# EAGLE design sparkpunk (EAGLE 6.5.0)
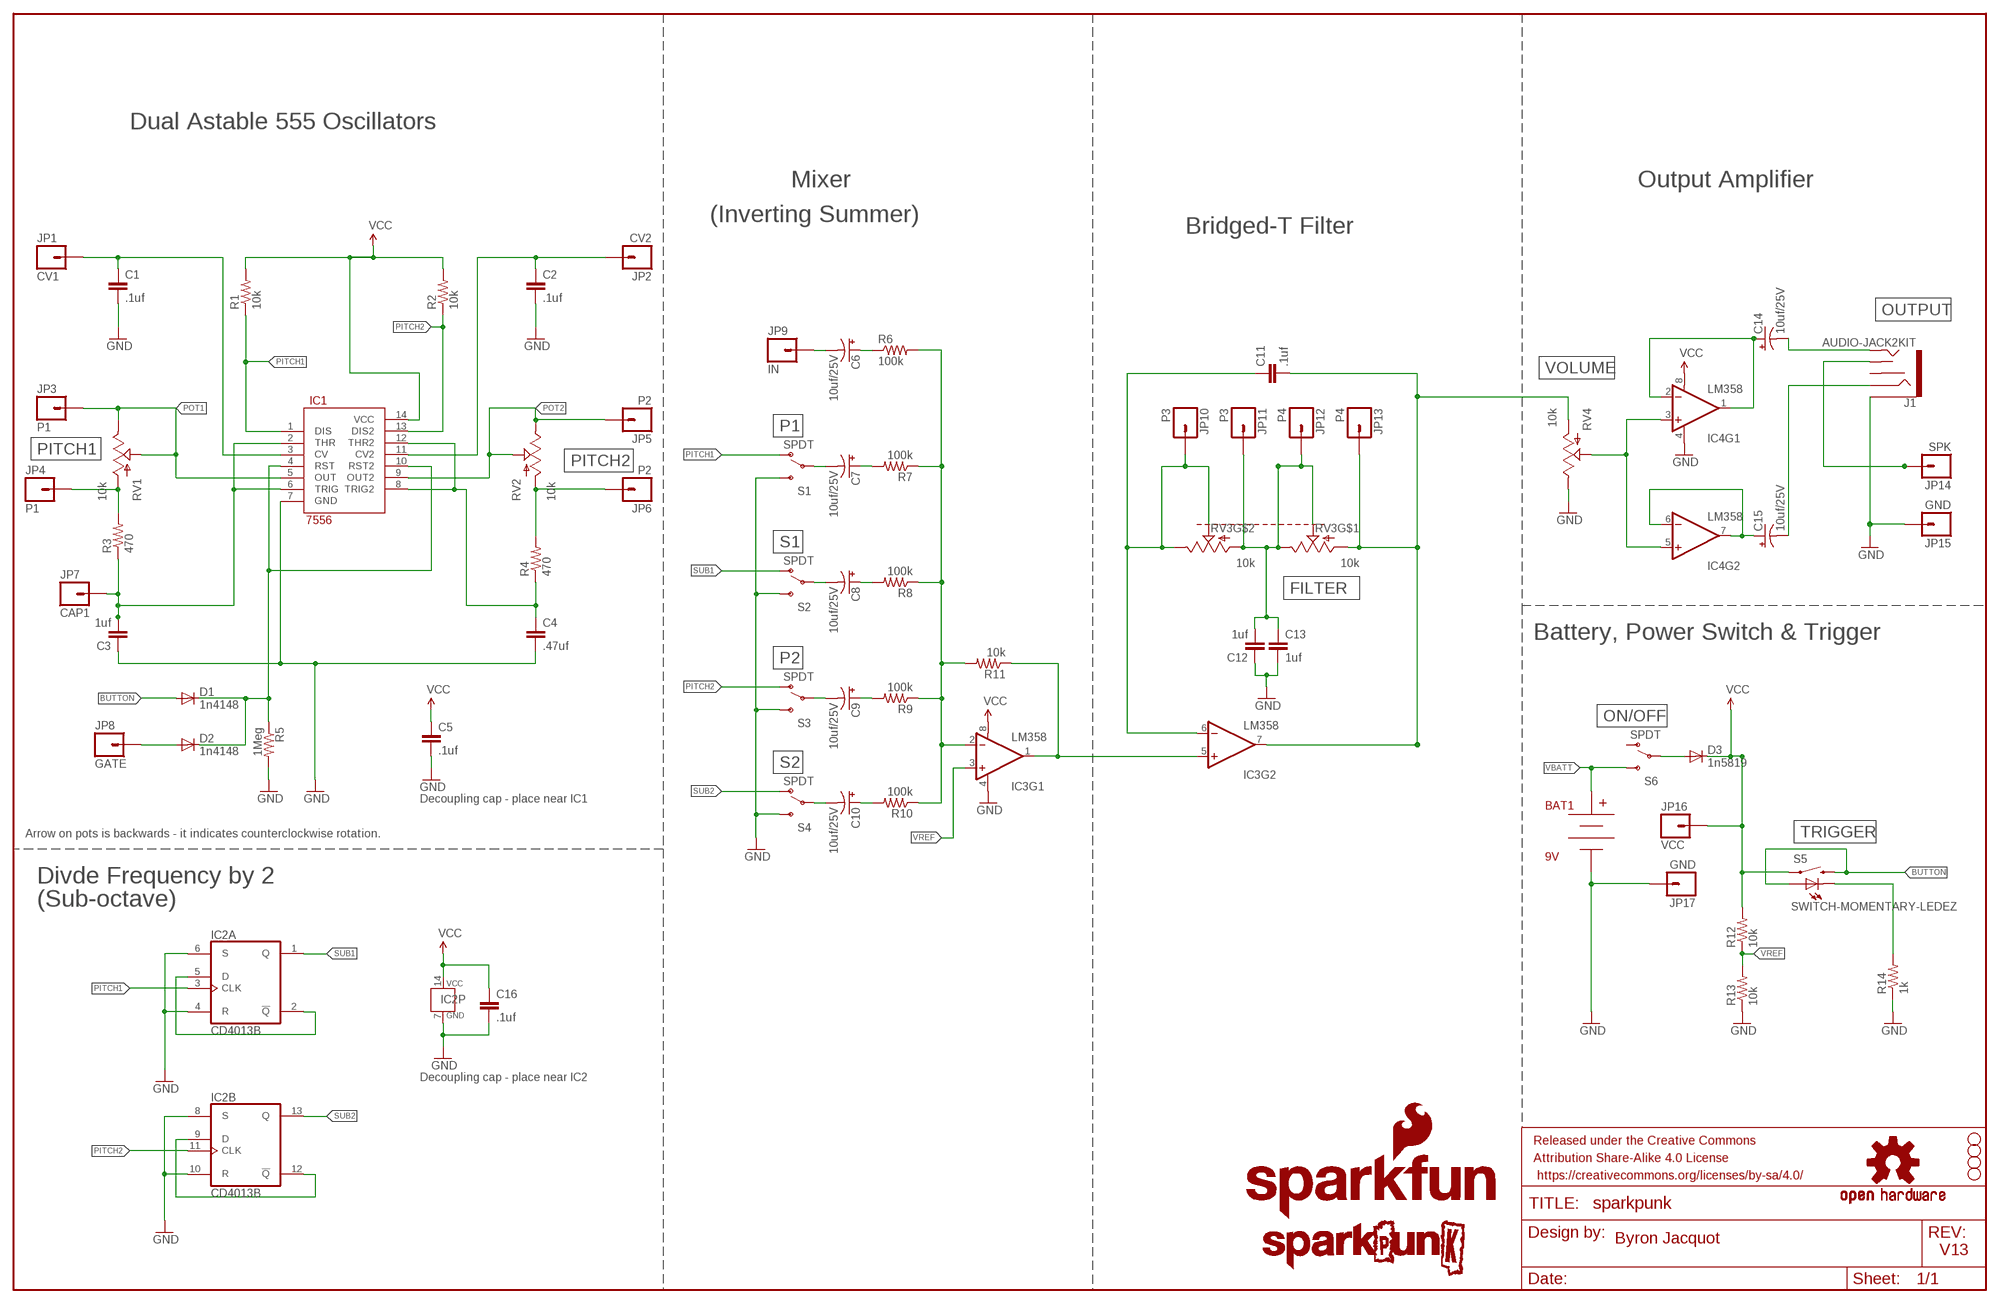
[diagram p0: schematic, sheet 1]

## Parts
BAT1  9V  BC9VPCKIT_SOLDERMASK  [BC9VPC_KIT]
C1  .1uf  CAPKIT  [CAP-PTH-SMALL-KIT]
C2  .1uf  CAPKIT  [CAP-PTH-SMALL-KIT]
C3  1uf  CAPKIT  [CAP-PTH-SMALL-KIT]
C4  .47uf  CAPKIT  [CAP-PTH-SMALL-KIT]
C5  .1uf  CAPKIT  [CAP-PTH-SMALL-KIT]
C6  10uf/25V  10UF-25V-20%(PTH)KIT  [CPOL-RADIAL-10UF-25V-KIT]
C7  10uf/25V  10UF-25V-20%(PTH)KIT  [CPOL-RADIAL-10UF-25V-KIT]
C8  10uf/25V  10UF-25V-20%(PTH)KIT  [CPOL-RADIAL-10UF-25V-KIT]
C9  10uf/25V  10UF-25V-20%(PTH)KIT  [CPOL-RADIAL-10UF-25V-KIT]
C10  10uf/25V  10UF-25V-20%(PTH)KIT  [CPOL-RADIAL-10UF-25V-KIT]
C11  .1uf  CAPKIT  [CAP-PTH-SMALL-KIT]
C12  1uf  CAPKIT  [CAP-PTH-SMALL-KIT]
C13  1uf  CAPKIT  [CAP-PTH-SMALL-KIT]
C14  10uf/25V  10UF-25V-20%(PTH)KIT  [CPOL-RADIAL-10UF-25V-KIT]
C15  10uf/25V  10UF-25V-20%(PTH)KIT  [CPOL-RADIAL-10UF-25V-KIT]
C16  .1uf  CAPKIT  [CAP-PTH-SMALL-KIT]
D1  1n4148  DIODEKIT  [DIODE-1N4148-KIT]
D2  1n4148  DIODEKIT  [DIODE-1N4148-KIT]
D3  1n5819  DIODE  [DIODE-1N4001-KIT]
FRAME1  FRAME-LEDGER  [CREATIVE_COMMONS]
IC1  7556  556KIT  [DIL14-KIT]
IC2  CD4013B  CD4013  [DIL14-KIT]
IC3  LM358  LM358KIT  [DIP08-KIT]
IC4  LM358  LM358KIT  [DIP08-KIT]
J1  AUDIO-JACK2KIT  [AUDIO-JACK-KIT]
JP1  CV1  M01SMDNS  [1X01NS]
JP2  CV2  M01SMDNS  [1X01NS]
JP3  P1  M01SMDNS  [1X01NS]
JP4  P1  M01SMDNS  [1X01NS]
JP5  P2  M01SMDNS  [1X01NS]
JP6  P2  M01SMDNS  [1X01NS]
JP7  CAP1  M01SMDNS  [1X01NS]
JP8  GATE  M01SMDNS  [1X01NS]
JP9  IN  M01SMDNS  [1X01NS]
JP10  P3  M01SMDNS  [1X01NS]
JP11  P3  M01SMDNS  [1X01NS]
JP12  P4  M01SMDNS  [1X01NS]
JP13  P4  M01SMDNS  [1X01NS]
JP14  SPK  M01SMDNS  [1X01NS]
JP15  GND  M01SMDNS  [1X01NS]
JP16  VCC  M01SMDNS  [1X01NS]
JP17  GND  M01SMDNS  [1X01NS]
LOGO1  SFE_LOGO_NAME_FLAME.2_INCH  [SFE_LOGO_NAME_FLAME_.2]
LOGO2  SPARKPUNK_LOGO.1INCH_TALL  [SPARKPUNK_LOGO_.1]
LOGO3  OSHW-LOGOM  [OSHW-LOGO-M]
LOGO4  OSHW-LOGOM  [OSHW-LOGO-M]
R1  10k  RESISTOREZ  [AXIAL-0.3EZ]
R2  10k  RESISTOREZ  [AXIAL-0.3EZ]
R3  470  RESISTOREZ  [AXIAL-0.3EZ]
R4  470  RESISTOREZ  [AXIAL-0.3EZ]
R5  1Meg  RESISTOREZ  [AXIAL-0.3EZ]
R6  100k  RESISTOREZ  [AXIAL-0.3EZ]
R7  100k  RESISTOREZ  [AXIAL-0.3EZ]
R8  100k  RESISTOREZ  [AXIAL-0.3EZ]
R9  100k  RESISTOREZ  [AXIAL-0.3EZ]
R10  100k  RESISTOREZ  [AXIAL-0.3EZ]
R11  10k  RESISTOREZ  [AXIAL-0.3EZ]
R12  10k  RESISTOREZ  [AXIAL-0.3EZ]
R13  10k  RESISTOREZ  [AXIAL-0.3EZ]
R14  1k  RESISTOREZ  [AXIAL-0.3EZ]
RV1  10k  POTALPS-KIT  [ALPS_POT_KIT]
RV2  10k  POTALPS-KIT  [ALPS_POT_KIT]
RV3  10k  POT_DUAL  [POT_PANASONIC_DUAL_VERT_KIT]
RV4  10k  POTALPS-KIT  [ALPS_POT_KIT]
S1  SPDT  SWITCH-SPDTKIT  [SWITCH-SPDT_KIT]
S2  SPDT  SWITCH-SPDTKIT  [SWITCH-SPDT_KIT]
S3  SPDT  SWITCH-SPDTKIT  [SWITCH-SPDT_KIT]
S4  SPDT  SWITCH-SPDTKIT  [SWITCH-SPDT_KIT]
S5  SWITCH-MOMENTARY-LEDEZ  [TACTILE-PTH-LED-12MM-EZ]
S6  SPDT  SWITCH-SPDTKIT  [SWITCH-SPDT_KIT]
STANDOFF1  STAND-OFF  [STAND-OFF]
STANDOFF2  STAND-OFF  [STAND-OFF]
STANDOFF3  STAND-OFF  [STAND-OFF]
STANDOFF4  STAND-OFF  [STAND-OFF]

## Nets
BUTTON: D1.A S5.2 S5.A
FILT-OUT: C11.2 IC3.7(OUT) JP13.1 RV3.A3(A) RV4.P$3(A)
GND: BAT1.V- C1.2 C2.2 C3.1 C4.2 C5.2 C12.1 C13.2 C16.2 IC1.7(GND) IC2.4(A:R) IC2.6(A:S) IC2.7(P:GND) IC2.8(B:S) IC2.10(B:R) IC3.4(V-) IC4.4(V-) J1.SLEEVE JP15.1 JP17.1 R5.P$2 R13.P$1 R14.P$1 RV4.P$1(E) S1.3(S) S2.3(S) S3.3(S) S4.3(S)
N: IC4.3(+IN) IC4.5(+IN) RV4.P$2(S)
N$1: D2.A JP8.1
N$3: C4.1 IC1.8(TRIG2) IC1.12(THR2) R4.P$1
N$4: D1.C D2.C IC1.4(RST) IC1.10(RST2) R5.P$1
N$7: D3.A S6.2(P)
N$8: JP6.1 R4.P$2 RV2.P$3(A)
N$9: R14.P$2 S5.C
N$10: IC2.2(A:!Q) IC2.5(A:D)
N$11: IC2.9(B:D) IC2.12(B:!Q)
N$12: JP4.1 R3.P$2 RV1.P$3(A)
N$13: C10.2(-) S4.2(P)
N$14: J1.TSH JP14.1
N$16: C14.1(+) IC4.1(OUT) IC4.2(-IN)
N$17: C15.2(-) J1.RING
N$18: C10.1(+) R10.P$2
N$19: C9.1(+) R9.P$2
N$20: C9.2(-) S3.2(P)
N$21: C6.2(-) JP9.1
N$22: C6.1(+) R6.P$1
N$23: C7.2(-) S1.2(P)
N$24: C8.2(-) S2.2(P)
N$25: C15.1(+) IC4.6(-IN) IC4.7(OUT)
N$26: IC3.2(-IN) R6.P$2 R7.P$1 R8.P$1 R9.P$1 R10.P$1 R11.P$2
N$27: IC3.1(OUT) IC3.5(+IN) R11.P$1
N$28: C8.1(+) R8.P$2
N$29: C7.1(+) R7.P$2
N$30: C14.2(-) J1.TIP
N$31: C11.1 IC3.6(-IN) JP10.1 RV3.B1(E) RV3.B2(S)
N$33: C12.2 C13.1 JP11.1 JP12.1 RV3.A1(E) RV3.A2(S) RV3.B3(A)
PITCH1: IC1.1(DIS) IC2.3(A:CLK) R1.P$1 S1.1(O)
PITCH2: IC1.13(DIS2) IC2.11(B:CLK) R2.P$1 S3.1(O)
POT1: IC1.5(OUT) JP3.1 RV1.P$1(E) RV1.P$2(S)
POT2: IC1.9(OUT2) JP5.1 RV2.P$1(E) RV2.P$2(S)
SUB1: IC2.1(A:Q) S2.1(O)
SUB2: IC2.13(B:Q) S4.1(O)
VBATT: BAT1.V+ S6.3(S)
VCAP1: C3.2 IC1.2(THR) IC1.6(TRIG) JP7.1 R3.P$1
VCC: C5.1 C16.1 D3.C IC1.14(VCC) IC2.14(P:VCC) IC3.8(V+) IC4.8(V+) JP16.1 R1.P$2 R2.P$2 R12.P$2 S5.4
VCC1: C2.1 IC1.11(CV2) JP2.1
VCC2: C1.1 IC1.3(CV) JP1.1
VREF: IC3.3(+IN) R12.P$1 R13.P$2
Unconnected: J1.RSH S6.1(O)

## Notes on the sheet
- Dual Astable 555 Oscillators
- Mixer | Output Amplifier
- (Inverting Summer)
- Bridged-T Filter
- OUTPUT
- VOLUME
- P1
- PITCH1
- PITCH2
- S1
- FILTER
- Battery, Power Switch & Trigger
- P2
- ON/OFF
- S2
- Decoupling cap - place near IC1
- Arrow on pots is backwards - it indicates counterclockwise rotation. | TRIGGER
- Divde Frequency by 2
- (Sub-octave)
- Decoupling cap - place near IC2
- Byron Jacquot
- V13

## Library data of the parts
BAT1 = SparkFun-Connectors:BC9VPC: 9V board-mount battery cradle
C1 C2 C5 C11 C16 = SparkFun-Capacitors:CAP: Capacitor Standard 0603 ceramic capacitor, and 0.1" leaded capacitor.; PROD_ID: CAP-08370
C3 C12 = SparkFun-Capacitors:CAP: Capacitor Standard 0603 ceramic capacitor, and 0.1" leaded capacitor.; PROD_ID: CAP-09184
C4 = SparkFun-Capacitors:CAP: Capacitor Standard 0603 ceramic capacitor, and 0.1" leaded capacitor.; PROD_ID: CAP-09152
C6-C10 C14 C15 = SparkFun-Capacitors:10UF-25V-20%(PTH): CAP-08440; PROD_ID: CAP-08440
C13 = SparkFun-Capacitors:CAP: Capacitor Standard 0603 ceramic capacitor, and 0.1" leaded capacitor.; PROD_ID: CAP-9184
D1 D2 = SparkFun-DiscreteSemi:DIODE: Diode These are standard reverse protection diodes and small signal diodes. SMA package can handle up to about 1A. SOD-323 can handle about 200mA. What the SOD-323 package when ordering, there are some mfgs out there that are 5-pin packages.
D3 = SparkFun-DiscreteSemi:DIODE: Diode These are standard reverse protection diodes and small signal diodes. SMA package can handle up to about 1A. SOD-323 can handle about 200mA. What the SOD-323 package when ordering, there are some mfgs out there that are 5-pin packages.; DIST: sparkfun; DIST_ID: COM-10926; PROD_ID: DIO-11895
FRAME1 = SparkFun-Aesthetics:FRAME-LEDGER: Schematic Frame Standard 11x14 US Ledger frame
IC1 = SparkFun-AnalogIC:556: Dual timer circuit (2 555 timers in one package); PROD_ID: IC-11898; VALUE: 556
IC2 = SparkFun-DigitalIC:CD4013: Dual D-type Flip-Flop; PROD_ID: IC-11896
IC3 IC4 = SparkFun-AnalogIC:LM358: Jellybean op-amp; PROD_ID: IC-09172
J1 = SparkFun-Connectors:AUDIO-JACK2: Stereo audio jack with bypass switches. SMT version used on LilyPad MP3 board.; PROD_ID: CONN-08774
JP1-JP17 = SparkFun-Connectors:M01: Header 1 Standard 1-pin 0.1" header. Use with straight break away headers (SKU : PRT-00116), right angle break away headers (PRT-00553), swiss pins (PRT-00743), machine pins (PRT-00117), and female headers (PRT-00115).
LOGO1 = SparkFun-Aesthetics:SFE_LOGO_NAME_FLAME: SFE Logo, name and flame This is the SparkFun full logo. The logo on the schematic will always be the same size; the package variant is the height of the flame part of the logo. Default layer for the logo on the board is tSilk.
LOGO2 = SparkFun-Aesthetics:SPARKPUNK_LOGO
LOGO3 LOGO4 = SparkFun-Aesthetics:OSHW-LOGO: Open Source Hardware Logo This logo indicates the piece of hardware it is found on incorporates a OSHW license and/or adheres to the definition of open source hardware found here: http://freedomdefined.org/OSHW
R1 R2 R11-R13 = SparkFun-Resistors:RESISTOR: Resistor Basic schematic elements and footprints for 0603, 1206, and PTH resistors.; PROD_ID: RES-09435
R3 R4 = SparkFun-Resistors:RESISTOR: Resistor Basic schematic elements and footprints for 0603, 1206, and PTH resistors.; PROD_ID: RES-10693
R5 = SparkFun-Resistors:RESISTOR: Resistor Basic schematic elements and footprints for 0603, 1206, and PTH resistors.; PROD_ID: RES-09329
R6-R10 = SparkFun-Resistors:RESISTOR: Resistor Basic schematic elements and footprints for 0603, 1206, and PTH resistors.; PROD_ID: RES-10686
R14 = SparkFun-Resistors:RESISTOR: Resistor Basic schematic elements and footprints for 0603, 1206, and PTH resistors.; PROD_ID: RES-08380
RV1 RV2 RV4 = SparkFun-Electromechanical:POT; PROD_ID: RES-09177
RV3 = SparkFun-Electromechanical:POT_DUAL; DIST: digikey; DIST_ID: P2A5103-ND; PROD_ID: RES-11897
S1-S4 S6 = SparkFun-Electromechanical:SWITCH-SPDT: SPDT Switch Simple slide switch, Spark Fun Electronics SKU : COM-00102 DPDT SMT slide switch, AYZ0202, SWCH-08179; PROD_ID: SWCH-08261
S5 = SparkFun-Electromechanical:SWITCH-MOMENTARY-LED: EZ is for Kits. There is no tStop (covering up the top side of the pads with mask). This helps the beginner see which side they should be soldering too.; PROD_ID: SWCH-11758
STANDOFF1-STANDOFF4 = SparkFun-Electromechanical:STAND-OFF: #4 Stand Off This is the mechanical footprint for a #4 phillips button head screw. Use the keepout ring to avoid running the screw head into surrounding components. SKU : PRT-00447

## Board
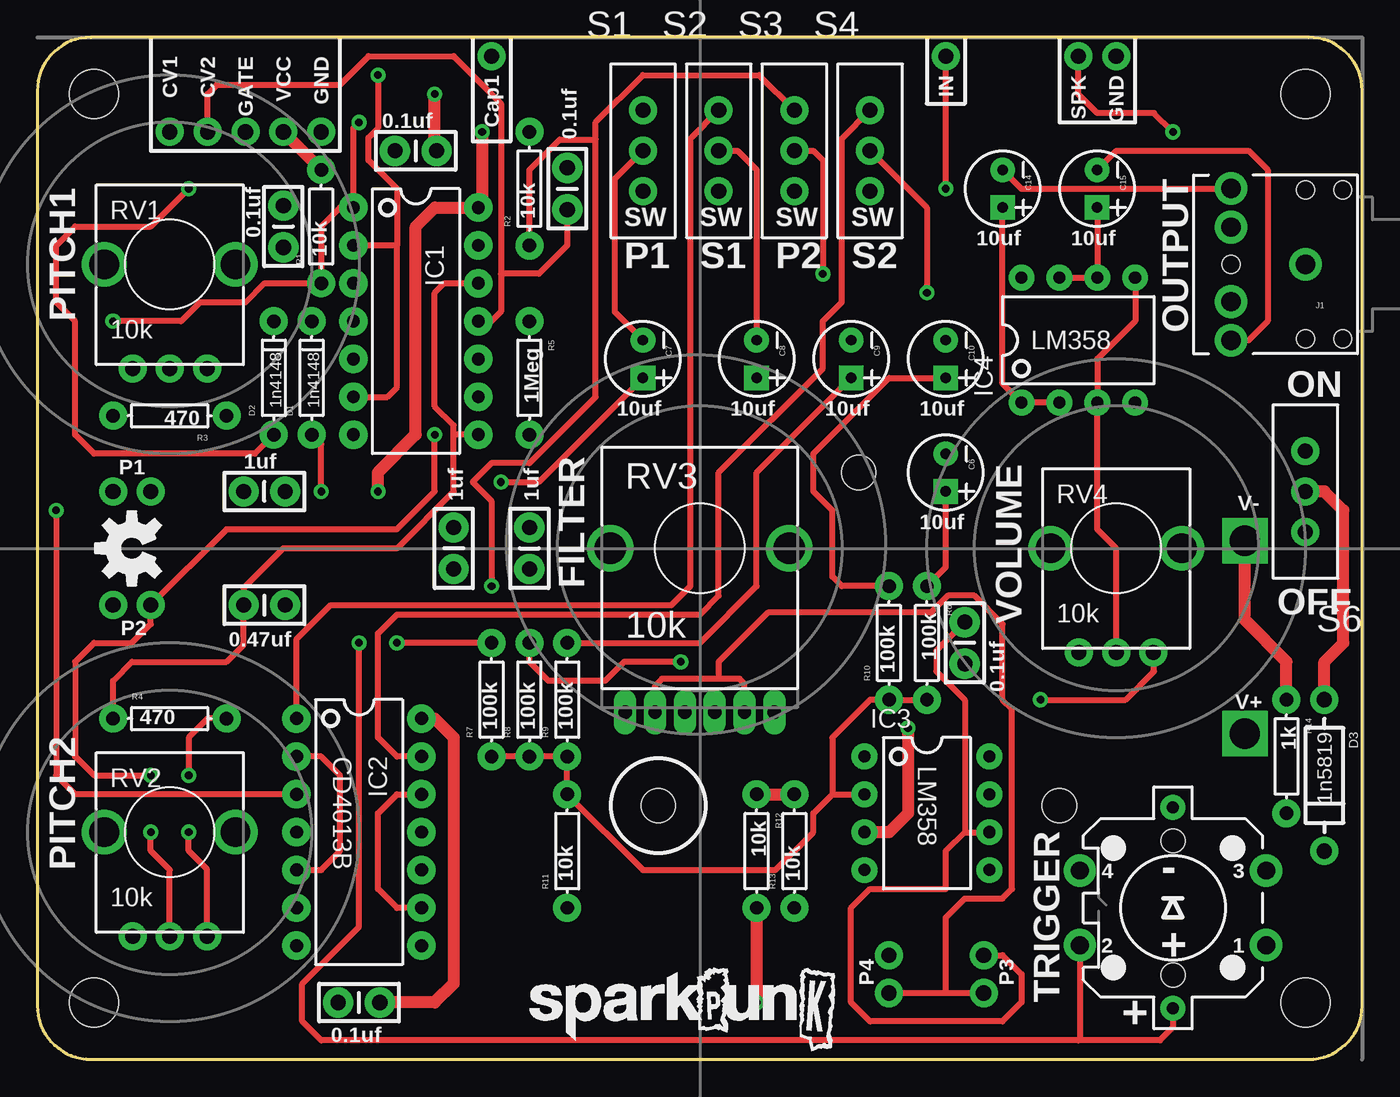
[diagram p1: board, top side]
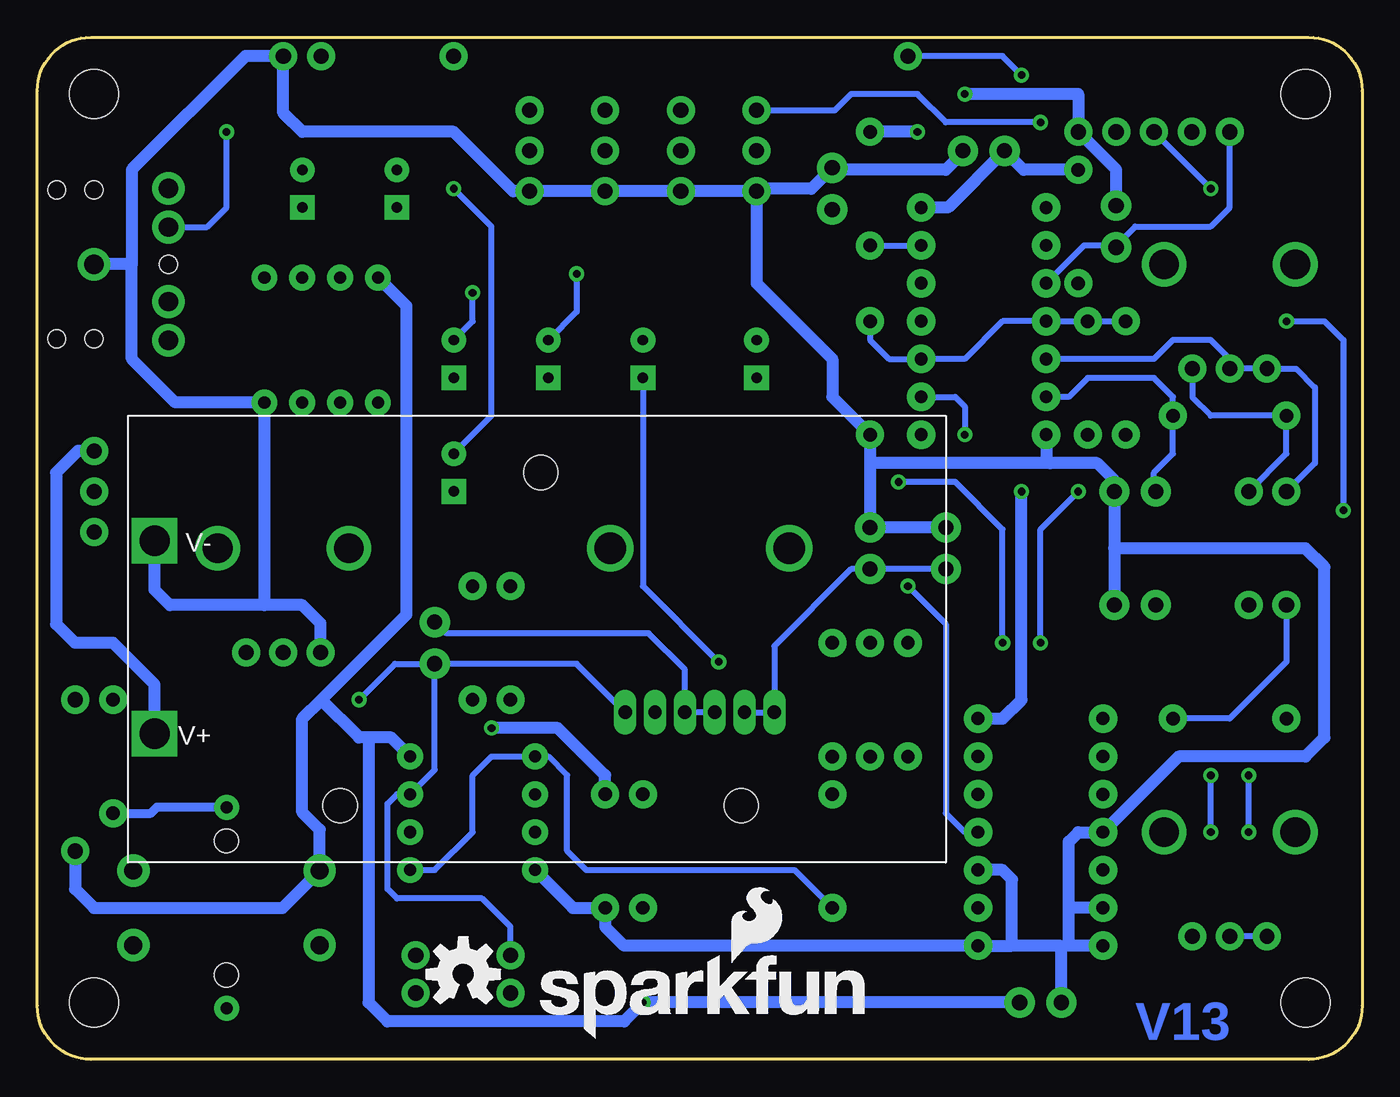
[diagram p2: board, bottom side, seen from below]

Size 88.9 x 68.58 mm. Coordinates in mm from the lower left corner, seen from the top.
Outline: 0,64.99 0,3.59 arc90 3.59,0 85.31,0 arc90 88.9,3.59 88.9,64.99 arc90 85.31,68.58 3.59,68.58 arc90 0,64.99
Copper layers (1*16): Top 0.035mm / dielectric 1.5mm / Bottom 0.035mm
Design rules "SparkFun-2-layer *": minimum track width 7mil, minimum drill 15mil, track to track 8mil, track to pad 8mil, pad to pad 8mil, via to via 8mil, smd to smd 8mil, copper to edge 8mil, drill to drill 8mil, minimum pad ring 12mil, minimum via ring 10mil, stop-mask expansion 4mil, vias tented up to drill 20mil, thermal gap 10mil

### Footprints (pad centres in the part's own frame; a part is rotated, then mirrored left to right if it is on the bottom)
BC9VPC_KIT = drill 2.032 square: V+ 53.086,21.336; V- 53.086,8.382 | hole 2.286: 27.178,3.81; 13.716,26.162; 40.64,26.162
CAP-PTH-SMALL-KIT = drill 1.016 pad 2.032: 1 -1.397,0; 2 1.397,0
CPOL-RADIAL-10UF-25V-KIT = drill 0.7 pad 1.651 square: 1 1.27,0 | drill 0.7 pad 1.651: 2 -1.27,0
DIODE-1N4148-KIT = drill 0.9 pad 1.88: A -3.81,0; C 3.81,0
DIODE-1N4001-KIT = drill 1.016 pad 1.88: A -5.08,0; C 5.08,0
DIL14-KIT = drill 0.864 pad 1.905: 1 -8.89,-4.191; 2 -6.35,-4.191; 3 -3.81,-4.191; 4 -1.27,-4.191; 5 1.27,-4.191; 6 3.81,-4.191; 7 6.35,-4.191; 8 6.35,4.191; 9 3.81,4.191; 10 1.27,4.191; 11 -1.27,4.191; 12 -3.81,4.191; 13 -6.35,4.191; 14 -8.89,4.191
DIP08-KIT = drill 0.813 pad 1.727: 1 -3.81,-4.191; 2 -1.27,-4.191; 3 1.27,-4.191; 4 3.81,-4.191; 5 3.81,4.191; 6 1.27,4.191; 7 -1.27,4.191; 8 -3.81,4.191
AUDIO-JACK-KIT = drill 1.3 pad 2.184: RING 5,5.1; RSH 5,2.5; SLEEVE 0,0; TIP 5,-5.1; TSH 5,-2.5 | hole 1.2: 0,5; -2.5,5; -2.5,-5; 0,-5; 5,0
1X01NS = drill 1.016 pad 1.88: 1 0,0
AXIAL-0.3EZ = drill 0.9 pad 1.88: P$1 -3.81,0; P$2 3.81,0
ALPS_POT_KIT = drill 1 pad 1.88: P$1 7,-2.5; P$2 7,0; P$3 7,2.5 | drill 2: P$4 0,-4.4; P$5 0,4.4
POT_PANASONIC_DUAL_VERT_KIT = drill 0.9 long: A1 11,-3; A2 11,-5; A3 11,5; B1 11,-1; B2 11,1; B3 11,3 | drill 2.1: P$4 0,-6; P$5 0,6
SWITCH-SPDT_KIT = drill 1.016 pad 1.88: 1 0,2.718; 2 0,0; 3 0,-2.718
TACTILE-PTH-LED-12MM-EZ = drill 1.2 pad 2.159: 1 -6.25,2.5; 2 6.25,2.5; 3 -6.25,-2.5; 4 6.25,-2.5 | drill 0.8 pad 1.676: A 0,6.75; C 0,-6.75 | hole 1.6: 0,4.5; 0,-4.5
STAND-OFF = hole 3.302: 0,0

### Placement (x,y rotation side)
BAT1  27.94,43.18 180 bottom
C1  16.51,55.88 90 top
C2  35.56,58.42 90 top
C3  15.24,38.1 180 top
C4  15.24,30.48 0 top
C5  25.4,60.96 0 top
C6  60.96,39.37 270 top
C7  40.64,46.99 270 top
C8  48.26,46.99 270 top
C9  54.61,46.99 270 top
C10  60.96,46.99 270 top
C11  62.23,27.94 270 top
C12  27.94,34.29 270 top
C13  33.02,34.29 90 top
C14  64.77,58.42 270 top
C15  71.12,58.42 270 top
C16  21.59,3.81 180 top
D1  18.41,45.72 90 top
D2  15.88,45.72 90 top
D3  86.36,19.05 270 top
FRAME1  24.13,-12.7 0 top  (outside the outline)
IC1  25.4,48.26 270 top
IC2  21.59,13.97 270 top
IC3  59.69,16.51 270 top
IC4  69.85,48.26 0 top
J1  85.09,53.34 180 top
JP1  8.89,62.23 0 top
JP2  11.43,62.23 0 top
JP3  5.08,38.1 0 top
JP4  7.62,38.1 0 top
JP5  7.62,30.48 0 top
JP6  5.08,30.48 0 top
JP7  30.48,67.31 0 top
JP8  13.97,62.23 0 top
JP9  60.96,67.31 0 top
JP10  63.5,6.99 180 top
JP11  63.5,4.45 180 top
JP12  57.15,4.45 180 top
JP13  57.15,6.99 180 top
JP14  69.85,67.31 90 top
JP15  72.39,67.31 0 top
JP16  16.51,62.23 0 top
JP17  19.05,62.23 0 top
LOGO1  55.88,1.27 0 bottom
LOGO2  33.02,2.54 0 top
LOGO3  6.35,34.29 90 top
LOGO4  60.33,5.71 0 bottom
R1  19.05,55.88 90 top
R2  33.02,58.42 90 top
R3  8.89,43.18 180 top
R4  8.89,22.86 0 top
R5  33.02,45.72 270 top
R6  59.69,27.94 270 top
R7  30.48,24.13 90 top
R8  33.02,24.13 90 top
R9  35.56,24.13 90 top
R10  57.15,27.94 90 top
R11  35.56,13.97 90 top
R12  48.26,13.97 270 top
R13  50.8,13.97 90 top
R14  83.82,20.32 270 top
RV1  8.89,53.34 270 top
RV2  8.89,15.24 270 top
RV3  44.45,34.29 270 top
RV4  72.39,34.29 270 top
S1  40.64,60.96 0 top
S2  45.72,60.96 0 top
S3  50.8,60.96 0 top
S4  55.88,60.96 0 top
S5  76.2,10.16 180 top
S6  85.09,38.1 180 top
STANDOFF1  3.81,3.81 0 top
STANDOFF2  85.09,3.81 0 top
STANDOFF3  3.81,64.77 0 top
STANDOFF4  85.09,64.77 0 top

### Tracks (layer width: path | path; a pad name or v marks a point on that pad's centre or on a via)
BUTTON  (via drill 0.51)
  Top 0.406: 69.85,1.27 75.33,1.27 76.2,2.14 S5.A | 69.85,1.27 19.05,1.27 17.78,2.54 17.78,5.08 21.59,8.89 v21.59,27.94 | v19.05,38.1 19.05,41.27 D1.A | S5.2 69.95,1.37 69.85,1.27
  Bottom 0.406: v21.59,27.94 21.59,35.56 v19.05,38.1
FILT-OUT  (via drill 0.51)
  Top 0.406: v67.31,24.13 73.03,24.13 74.93,26.04 74.93,27.25 RV4.P$3
  Bottom 0.406: v67.31,24.13 64.9,26.54 C11.2 | C11.2 62.23,19.43 IC3.7 64.77,17.78 65.41,17.14 65.41,11.43 64.77,10.79 59.05,10.79 57.15,8.89 JP13.1 | RV3.A3 52.7,26.54 C11.2
GND  (via drill 0.51)
  Top 0.406: C5.2 26.67,61.09
  Top 0.813: 26.67,61.09 v26.67,64.77 | R14.P$1 83.82,26.67 81.03,29.46 BAT1.V-
  Bottom 0.61: 19.68,7.62 20.32,7.62 20.19,7.49 | S1.3 40.46,58.42
  Bottom 0.813: S1.3 S2.3 S3.3 S4.3 56.97,58.24 60.96,62.23 71.12,62.23 72.39,63.5 JP15.1 74.93,67.31 82.55,59.69 82.55,53.34 | S1.3 40.64,52.07 35.56,46.99 35.56,44.45 R5.P$2 33.02,40.01 | C12.1 C13.2 33.02,40.01 | 20.95,40.01 17.78,40.01 16.64,38.86 C3.1 16.64,34.29 | 20.95,40.01 33.02,40.01 | 16.64,34.29 C4.2 | 16.64,34.29 3.81,34.29 2.54,33.02 2.54,21.59 3.81,20.32 12.32,20.32 IC2.4 19.05,15.24 19.68,14.61 19.68,10.16 | 20.32,7.62 23.5,7.62 | 23.5,7.62 IC2.8 49.53,7.62 50.8,8.89 R13.P$1 52.96,10.16 IC3.4 | 23.5,7.62 23.5,12.06 24.13,12.7 IC2.10 | IC2.7 19.68,7.62 19.68,10.16 | IC2.6 19.68,10.16 | 73.66,30.48 IC4.4 79.63,44.07 82.55,46.99 82.55,53.34 | C16.2 20.19,7.49 | C1.2 16.51,59.69 JP17.1 19.05,64.77 v26.67,64.77 | 40.46,58.42 36.96,58.42 C2.2 35.43,59.69 27.94,59.69 26.8,60.83 C5.2 | S1.3 40.64,55.88 | 82.55,53.34 J1.SLEEVE | RV4.P$1 69.89,29.25 71.12,30.48 73.66,30.48 | 73.66,30.48 80.01,30.48 81.03,31.5 BAT1.V- | IC1.7 21.21,40.26 20.95,40.01
N
  Top 0.406: IC4.5 73.66,49.53 71.12,46.99 IC4.3 71.12,35.56 72.39,34.29 RV4.P$2
N$1  (via drill 0.51)
  Top 0.406: D2.A 14.61,40.64 3.81,40.64 2.54,41.91 2.54,49.53 1.27,50.8 1.27,54.61 2.54,55.88 7.62,55.88 v10.16,58.42
  Bottom 0.406: v10.16,58.42 JP8.1
N$3
  Top 0.406: IC1.12 27.3,52.07 26.67,51.44 26.67,43.81 27.94,42.55 27.94,41.91 | R4.P$1 5.08,25.4 6.35,26.67 12.7,26.67 13.84,27.81 C4.1 13.84,31.62 16.51,34.29 24.13,34.29 27.94,38.1 27.94,41.91 | IC1.8 27.94,41.91
N$4
  Bottom 0.406: D2.C D1.C IC1.4 24.13,49.53 26.67,46.99 IC1.10 31.75,46.99 33.02,48.26 R5.P$1
N$7
  Top 0.813: D3.A 86.36,26.67 87.63,27.94 87.63,36.83 86.36,38.1 S6.2
N$8  (via drill 0.51)
  Top 0.406: RV2.P$3 11.39,12.74 10.16,13.97 v10.16,15.24 | R4.P$2 11.43,22.86 10.16,21.59 v10.16,19.05
  Bottom 0.406: JP6.1 5.08,26.67 8.89,22.86 R4.P$2 | v10.16,15.24 v10.16,19.05
N$9
  Bottom 0.61: R14.P$2 81.28,16.51 80.88,16.91 S5.C
N$10
  Top 0.406: IC2.5 19.05,12.7 20.32,13.97 20.32,19.05 19.05,20.32 IC2.2
N$11
  Top 0.406: IC2.9 24.13,10.16 22.86,11.43 22.86,16.51 24.13,17.78 IC2.12
N$12
  Bottom 0.406: JP4.1 5.08,40.64 R3.P$2 10.16,43.18 11.39,44.41 RV1.P$3
N$13  (via drill 0.51)
  Top 0.406: S4.2 59.69,57.15 v59.69,51.44
  Bottom 0.406: C10.2 59.69,49.53 v59.69,51.44
N$14  (via drill 0.51)
  Top 0.406: v76.2,62.23 74.93,63.5 71.12,63.5 69.85,64.77 JP14.1
  Bottom 0.406: J1.TSH 77.51,55.84 76.2,57.15 v76.2,62.23
N$16
  Top 0.406: IC4.2 IC4.1 | IC4.1 66.42,44.07 | C14.1 64.77,45.34 IC4.1
N$17
  Top 0.406: C15.2 72.39,60.96 81.28,60.96 82.55,59.69 82.55,49.53 81.26,48.24 J1.RING
N$18
  Top 0.406: C10.1 57.15,45.72 52.07,40.64 52.07,38.1 53.34,36.83 53.34,32.38 53.98,31.75 R10.P$2
N$19
  Top 0.406: R9.P$2 44.45,27.94 48.26,31.75 48.26,39.37 C9.1
N$20  (via drill 0.51)
  Top 0.406: S3.2 52.07,60.96 52.7,60.33 v52.7,52.7
  Bottom 0.406: v52.7,52.7 52.7,50.16 C9.2
N$21  (via drill 0.51)
  Top 0.406: v60.96,58.42 JP9.1
  Bottom 0.406: C6.2 58.42,43.18 58.42,55.88 v60.96,58.42
N$22
  Top 0.406: C6.1 60.96,33.02 R6.P$1
N$23
  Top 0.406: C7.2 38.73,50.16 38.73,59.05 S1.2
N$24
  Top 0.406: S2.2 46.99,60.96 48.26,59.69 C8.2
N$25
  Top 0.406: IC4.7 IC4.6 C15.1
N$26
  Top 0.406: R7.P$1 R8.P$1 R9.P$1 R11.P$2 40.64,12.7 49.53,12.7 52.07,15.24 52.07,16.51 53.34,17.78 | R6.P$2 R10.P$1 55.88,24.13 53.34,21.59 53.34,17.78 | 53.34,17.78 IC3.2
N$27
  Bottom 0.406: IC3.5 62.23,12.7 59.69,15.24 59.69,19.05 58.42,20.32 IC3.1 54.61,20.32 53.34,19.05 53.34,13.97 52.07,12.7 38.1,12.7 R11.P$1
N$28  (via drill 0.51)
  Top 0.406: v43.18,26.67 39.37,26.67 38.1,25.4 34.29,25.4 33.02,26.67 R8.P$2
  Bottom 0.406: C8.1 48.26,31.75 v43.18,26.67
N$29  (via drill 0.51)
  Top 0.406: R7.P$2 v24.13,27.94 | v31.11,38.73 33.66,38.73 C7.1
  Bottom 0.406: v24.13,27.94 24.13,35.56 27.3,38.73 v31.11,38.73
N$30
  Top 0.406: J1.TIP 80.07,58.42 66.04,58.42 C14.2
N$31
  Top 0.406: JP10.1 64.77,6.99 66.04,5.71 66.04,3.81 64.77,2.54 55.88,2.54 54.61,3.81 54.61,10.16 55.88,11.43 60.96,11.43 60.96,13.97 62.23,15.24 | 62.23,15.24 IC3.6 | 62.23,15.24 62.23,24.13 60.33,26.04 60.33,27.43 C11.1
  Bottom 0.406: C11.1 61.47,28.57 47.88,28.57 45.45,26.15 RV3.B2 RV3.B1
N$33
  Top 0.406: 60.96,4.45 JP11.1 | JP12.1 60.96,4.45 | 60.96,4.45 60.96,9.53 62.23,10.79 64.77,10.79 65.41,11.43 65.41,23.5 64.77,24.13 64.77,29.21 62.87,31.11 61.09,31.11 59.94,29.97 49.02,29.97 45.72,26.67 45.72,25.53 | RV3.A1 41.45,25.07 41.91,25.53 45.72,25.53 | RV3.B3 47.45,25.19 47.12,25.53 45.72,25.53
  Bottom 0.406: C12.2 C13.1 34.29,32.89 39.45,27.73 RV3.A2 RV3.A1
PITCH1  (via drill 0.51)
  Top 0.406: IC2.3 2.54,17.78 1.27,19.05 v1.27,36.83 | v5.08,49.53 9.65,49.53 10.92,50.8 13.97,50.8 15.24,52.07 R1.P$1 19.05,55.88 20.32,57.15 IC1.1 21.21,62.48 v21.59,62.87
  Bottom 0.406: v21.59,62.87 27.94,62.87 29.84,64.77 34.29,64.77 35.38,63.68 S1.1 | v5.08,49.53 2.54,49.53 1.27,48.26 v1.27,36.83
PITCH2  (via drill 0.51)
  Top 0.406: 37.47,61.72 37.47,44.45 33.02,40.01 30.48,40.01 29.21,38.73 30.48,37.47 v30.48,31.75 | 37.47,61.72 37.47,62.87 40.64,66.04 48.44,66.04 S3.1 | R2.P$1 33.02,59.69 35.05,61.72 37.47,61.72
  Bottom 0.406: R2.P$1 IC1.13 | v30.48,31.75 27.94,29.21 27.94,16.51 26.67,15.24 IC2.11
POT1
  Bottom 0.406: JP3.1 3.17,40.01 3.17,45.09 4.43,46.34 RV1.P$1 RV1.P$2 8.89,46.99 10.16,48.26 12.7,48.26 13.97,46.99 IC1.5
POT2  (via drill 0.51)
  Top 0.406: v26.67,41.91 v26.66,41.9 26.66,38.1 24.12,35.56 12.7,35.56 JP5.1 7.62,29.21 6.35,27.94 3.81,27.94 2.54,26.67 2.54,20.32 3.81,19.05 v7.62,19.05 | RV2.P$2 8.89,12.7 7.62,13.97 v7.62,15.24
  Bottom 0.406: IC1.9 27.3,44.45 26.67,43.81 v26.67,41.91 | RV2.P$1 RV2.P$2 | v7.62,15.24 v7.62,19.05
SUB1
  Top 0.406: S2.1 43.81,61.77 43.81,31.75 42.55,30.48 19.68,30.48 17.4,28.19 IC2.1
SUB2
  Top 0.406: S4.1 53.98,61.77 53.98,50.8 52.7,49.53 52.7,46.35 45.72,39.37 45.72,31.11 44.45,29.84 24.13,29.84 22.86,28.57 22.86,21.59 24.13,20.32 IC2.13
VBATT
  Bottom 0.813: BAT1.V+ 81.03,25.15 83.82,27.94 86.36,27.94 87.63,29.21 87.63,39.37 86.18,40.82 S6.3
VCAP1  (via drill 0.51)
  Top 0.406: IC1.6 23.5,44.45 24.13,45.09 24.13,54.61 | 24.13,54.61 IC1.2 | 24.13,54.61 24.13,58.42 22.23,60.33 22.23,61.85 22.86,62.48 v22.86,66.04
  Bottom 0.406: C3.2 13.97,38.23 13.97,39.37 12.7,40.64 R3.P$1 12.7,44.45 13.97,45.72 18.41,45.72 19.68,44.45 IC1.6 | JP7.1 24.13,67.31 v22.86,66.04
VCC  (via drill 0.51)
  Top 0.813: v22.86,38.1 22.86,39.37 25.4,41.91 25.4,55.88 26.67,57.15 IC1.14 29.84,57.4 v29.84,62.23 | R12.P$2 v48.26,3.81 | IC2.14 26.67,22.86 27.94,21.59 27.94,5.08 26.67,3.81 C16.1 | R1.P$2 JP16.1
  Bottom 0.406: 24,60.83 C5.1
  Bottom 0.813: 66.67,21.59 66.67,3.81 65.41,2.54 49.53,2.54 v48.26,3.81 C16.1 | 69.85,24.13 71.12,22.86 71.12,16.57 69.95,15.4 S5.4 72.45,10.16 85.09,10.16 86.36,11.43 D3.C | 69.85,24.13 64.14,29.84 64.14,50.55 IC4.8 | v22.86,38.1 22.86,24.13 24.13,22.86 IC2.14 | v29.84,62.23 R2.P$2 | IC3.8 65.15,21.59 66.67,21.59 | 66.67,21.59 67.31,21.59 69.85,24.13 | IC1.14 27.81,57.15 C5.1 22.73,59.69 R1.P$2
VCC1
  Top 0.406: 31.11,52.7 31.11,64.14 27.94,67.31 22.23,67.31 20.32,65.41 12.06,65.41 11.43,64.77 JP2.1 | 31.11,52.7 31.11,50.16 30.48,49.53 IC1.11 | C2.1 35.56,54.61 33.66,52.7 31.11,52.7
VCC2
  Bottom 0.406: JP1.1 8.89,57.15 10.16,55.88 15.24,55.88 16.51,54.61 C1.1 16.64,54.61 18.67,54.61 IC1.3
VREF  (via drill 0.51)
  Top 0.813: R12.P$1 R13.P$2 | v58.42,22.23 58.42,16.51 57.15,15.24 IC3.3
  Bottom 0.813: R13.P$2 50.8,19.05 53.98,22.23 v58.42,22.23

### Text on the board
Bottom: V13
tPlace: CV1 | CV2 | GATE | VCC | GND | Cap1 | IN | SPK | GND | 0.1uf | 0.1uf | SW | SW | SW | SW | 0.1uf | 10uf | 10uf | P1 | S1 | P2 | S2 | PITCH1 | OUTPUT | ON | 10uf | 10uf | 10uf | 10uf | 1uf | P1 | 1uf | 1uf | V- | 10uf | FILTER | OFF | VOLUME | P2 | 0.47uf | 0.1uf | V+ | PITCH2 | P4 | P3 | TRIGGER | 0.1uf
tDocu: Byron Jacquot